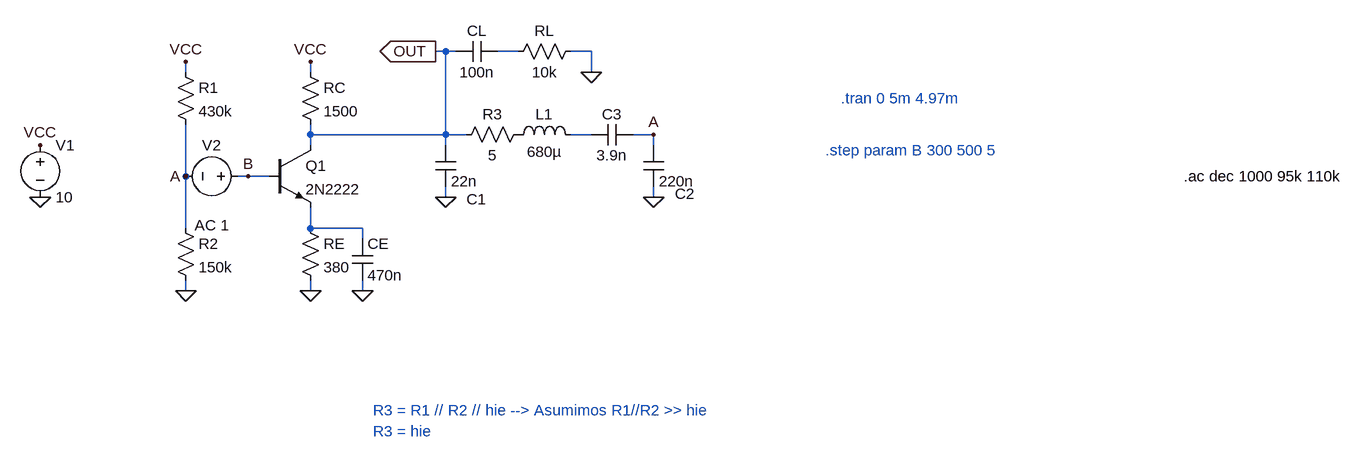
[diagram p0: schematic Oscilador Diaz-Chiocarello-Perretta.asc]
Oscilador Diaz-Chiocarello-Perretta.asc, the LTspice schematic file:
Version 4.1
SHEET 1 1848 760
WIRE 448 -48 432 -48
WIRE 464 -48 448 -48
WIRE 560 -48 528 -48
WIRE 672 -48 640 -48
WIRE 48 -16 48 -32
WIRE 240 -16 240 -32
WIRE 672 -16 672 -48
WIRE 240 80 240 64
WIRE 448 80 448 -48
WIRE 448 80 240 80
WIRE 480 80 448 80
WIRE 672 80 640 80
WIRE 768 80 736 80
WIRE 240 96 240 80
WIRE 448 96 448 80
WIRE 768 96 768 80
WIRE 48 144 48 64
WIRE 144 144 128 144
WIRE 176 144 144 144
WIRE 448 176 448 160
WIRE 768 176 768 160
WIRE 48 224 48 144
WIRE 240 224 240 192
WIRE 320 224 240 224
WIRE 320 240 320 224
WIRE 48 320 48 304
WIRE 240 320 240 304
WIRE 320 320 320 304
FLAG 240 320 0
FLAG 320 320 0
FLAG 48 320 0
FLAG 240 -32 VCC
FLAG 48 -32 VCC
FLAG 448 176 0
FLAG 768 176 0
FLAG 48 144 A
FLAG 768 80 A
FLAG -176 176 0
FLAG -176 96 VCC
FLAG 432 -48 OUT
IOPIN 432 -48 Out
FLAG 672 -16 0
FLAG 144 144 B
SYMBOL res 32 208 R0
SYMATTR InstName R2
SYMATTR Value 150k
SYMBOL res 32 -32 R0
SYMATTR InstName R1
SYMATTR Value 430k
SYMBOL npn2 176 96 R0
SYMATTR InstName Q1
SYMATTR Value 2N2222
SYMBOL res 224 208 R0
SYMATTR InstName RE
SYMATTR Value 380
SYMBOL cap 304 240 R0
SYMATTR InstName CE
SYMATTR Value 470n
SYMBOL res 224 -32 R0
SYMATTR InstName RC
SYMATTR Value 1500
SYMBOL cap 432 96 R0
WINDOW 0 48 83 Left 2
SYMATTR InstName C1
SYMATTR Value 22n
SYMBOL ind 544 96 R270
WINDOW 0 32 56 VTop 2
WINDOW 3 5 56 VBottom 2
SYMATTR InstName L1
SYMATTR Value 680µ
SYMATTR SpiceLine Rser=1m
SYMBOL cap 736 64 R90
WINDOW 0 0 32 VBottom 2
WINDOW 3 32 32 VTop 2
SYMATTR InstName C3
SYMATTR Value 3.9n
SYMBOL cap 752 96 R0
WINDOW 0 49 75 Left 2
SYMATTR InstName C2
SYMATTR Value 220n
SYMBOL voltage -176 80 R0
WINDOW 123 0 0 Left 0
WINDOW 39 0 0 Left 0
SYMATTR InstName V1
SYMATTR Value 10
SYMBOL cap 528 -64 R90
WINDOW 0 0 32 VBottom 2
WINDOW 3 32 32 VTop 2
SYMATTR InstName CL
SYMATTR Value 100n
SYMBOL res 656 -64 R90
WINDOW 0 0 56 VBottom 2
WINDOW 3 32 56 VTop 2
SYMATTR InstName RL
SYMATTR Value 10k
SYMBOL voltage 144 144 R90
WINDOW 0 -32 56 VBottom 2
WINDOW 3 32 56 VTop 2
WINDOW 123 60 56 VTop 2
WINDOW 39 0 0 Left 0
SYMATTR InstName V2
SYMATTR Value ""
SYMATTR Value2 AC 1
SYMBOL res 576 64 R90
WINDOW 0 0 56 VBottom 2
WINDOW 3 32 56 VTop 2
SYMATTR InstName R3
SYMATTR Value 5
TEXT 336 504 Left 2 ;R3 = R1 // R2 // hie --> Asumimos R1//R2 >> hie
TEXT 336 536 Left 2 ;R3 = hie
TEXT 1056 24 Left 2 ;.tran 0 5m 4.97m
TEXT 1032 104 Left 2 ;.step param B 300 500 5
TEXT 1584 144 Left 2 !.ac dec 1000 95k 110k

The netlist it stands for:
* Oscilador Diaz-Chiocarello-Perretta.asc
R2 A 0 150k
R1 VCC A 430k
Q1 OUT B N003 0 2N2222
RE N003 0 380
CE N003 0 470n
RC VCC OUT 1500
C1 OUT 0 22n
L1 P001 N002 680µ Rser=1m
C3 A N002 3.9n
C2 A 0 220n
V1 VCC 0 10
CL N001 OUT 100n
RL 0 N001 10k
V2 B A AC 1
R3 P001 OUT 5
.model NPN NPN
.model PNP PNP
.lib standard.bjt
* R3 = R1 // R2 // hie --> Asumimos R1//R2 >> hie
* R3 = hie
* .tran 0 5m 4.97m
* .step param B 300 500 5
.ac dec 1000 95k 110k
.backanno
.end